# Altium schematic sheet MainSchema.SchDoc
size A4
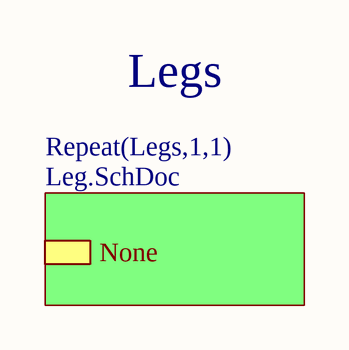
[diagram p0: MainSchema.SchDoc]

## Sub-sheets
Repeat(Legs,1,1) = Leg.SchDoc: None

## Notes on the sheet
- Legs